# Altium project PCB_Project1.PrjPCB
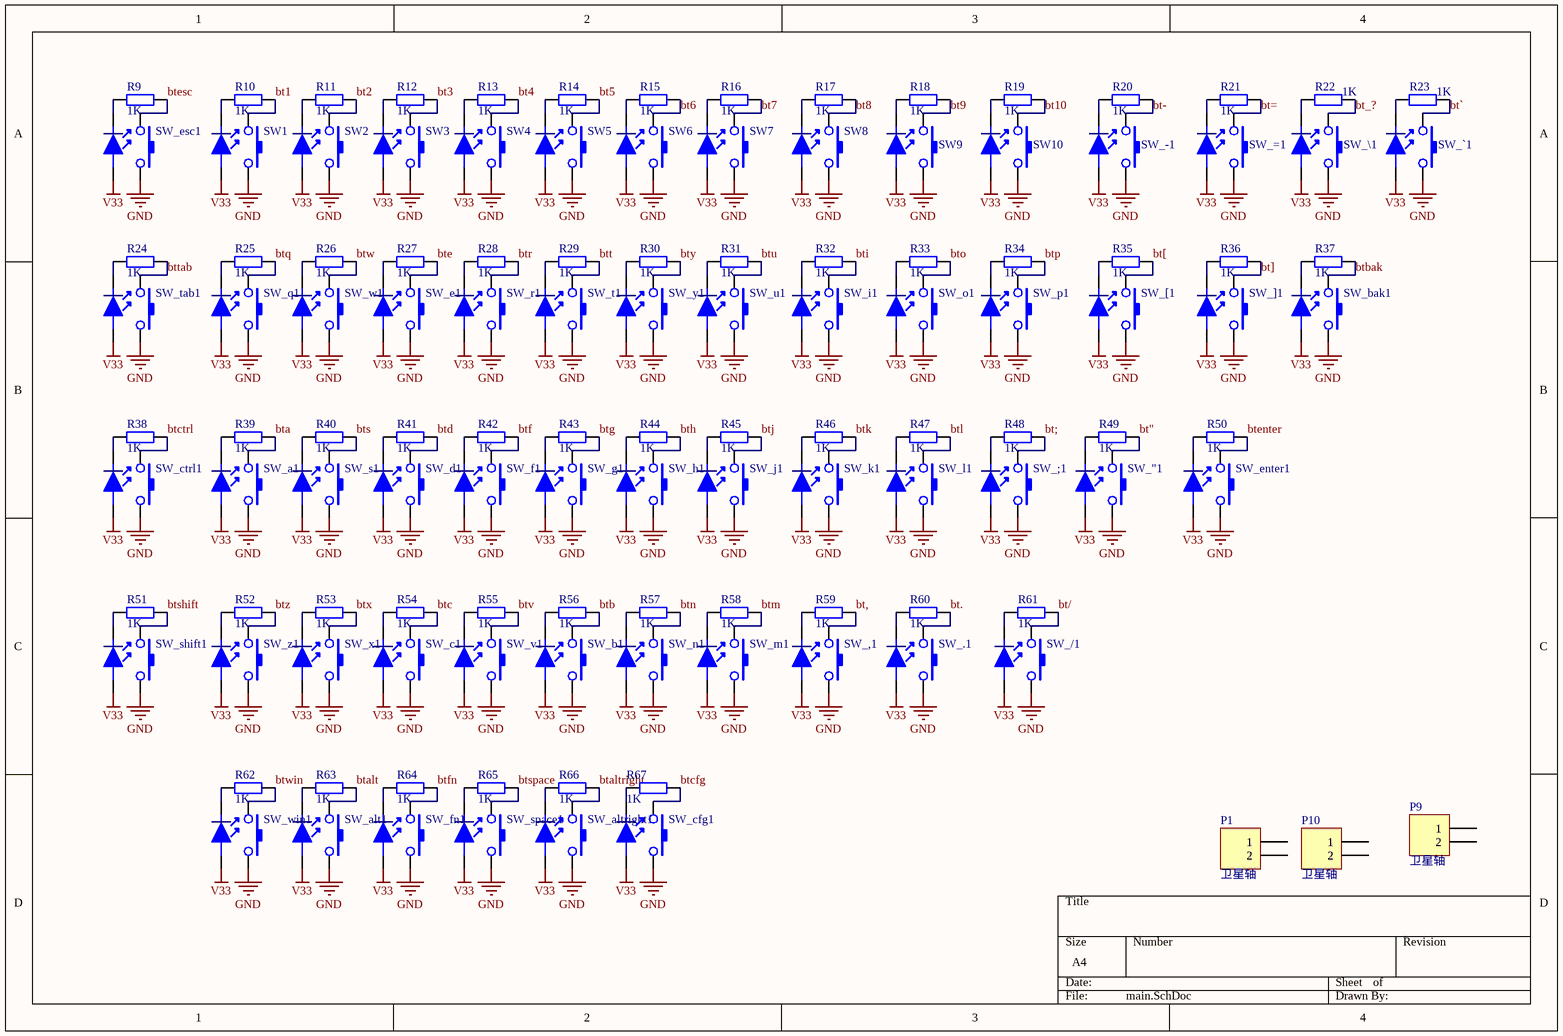
[diagram p0: main.SchDoc]
2 sheets, 150 parts. Net scope: global (net labels, ports and power ports of the same name join across sheets).
Board files: KBV1.2.PcbDoc, KBV1.3.PcbDoc
Sheets:
  main.SchDoc
  STM32F103VE.SchDoc

## Sheet main.SchDoc
size A4

### Parts
P1  卫星轴  [1x3]
P9  卫星轴  [1x2]
P10  卫星轴  [1x2]
R9  value 1K  [RES0805(2012M)]  (hidden comment: Res2)
R10  value 1K  [RES0805(2012M)]  (hidden comment: Res2)
R11  value 1K  [RES0805(2012M)]  (hidden comment: Res2)
R12  value 1K  [RES0805(2012M)]  (hidden comment: Res2)
R13  value 1K  [RES0805(2012M)]  (hidden comment: Res2)
R14  value 1K  [RES0805(2012M)]  (hidden comment: Res2)
R15  value 1K  [RES0805(2012M)]  (hidden comment: Res2)
R16  value 1K  [RES0805(2012M)]  (hidden comment: Res2)
R17  value 1K  [RES0805(2012M)]  (hidden comment: Res2)
R18  value 1K  [RES0805(2012M)]  (hidden comment: Res2)
R19  value 1K  [RES0805(2012M)]  (hidden comment: Res2)
R20  value 1K  [RES0805(2012M)]  (hidden comment: Res2)
R21  value 1K  [RES0805(2012M)]  (hidden comment: Res2)
R22  value 1K  [RES0805(2012M)]  (hidden comment: Res2)
R23  value 1K  [RES0805(2012M)]  (hidden comment: Res2)
R24  value 1K  [RES0805(2012M)]  (hidden comment: Res2)
R25  value 1K  [RES0805(2012M)]  (hidden comment: Res2)
R26  value 1K  [RES0805(2012M)]  (hidden comment: Res2)
R27  value 1K  [RES0805(2012M)]  (hidden comment: Res2)
R28  value 1K  [RES0805(2012M)]  (hidden comment: Res2)
R29  value 1K  [RES0805(2012M)]  (hidden comment: Res2)
R30  value 1K  [RES0805(2012M)]  (hidden comment: Res2)
R31  value 1K  [RES0805(2012M)]  (hidden comment: Res2)
R32  value 1K  [RES0805(2012M)]  (hidden comment: Res2)
R33  value 1K  [RES0805(2012M)]  (hidden comment: Res2)
R34  value 1K  [RES0805(2012M)]  (hidden comment: Res2)
R35  value 1K  [RES0805(2012M)]  (hidden comment: Res2)
R36  value 1K  [RES0805(2012M)]  (hidden comment: Res2)
R37  value 1K  [RES0805(2012M)]  (hidden comment: Res2)
R38  value 1K  [RES0805(2012M)]  (hidden comment: Res2)
R39  value 1K  [RES0805(2012M)]  (hidden comment: Res2)
R40  value 1K  [RES0805(2012M)]  (hidden comment: Res2)
R41  value 1K  [RES0805(2012M)]  (hidden comment: Res2)
R42  value 1K  [RES0805(2012M)]  (hidden comment: Res2)
R43  value 1K  [RES0805(2012M)]  (hidden comment: Res2)
R44  value 1K  [RES0805(2012M)]  (hidden comment: Res2)
R45  value 1K  [RES0805(2012M)]  (hidden comment: Res2)
R46  value 1K  [RES0805(2012M)]  (hidden comment: Res2)
R47  value 1K  [RES0805(2012M)]  (hidden comment: Res2)
R48  value 1K  [RES0805(2012M)]  (hidden comment: Res2)
R49  value 1K  [RES0805(2012M)]  (hidden comment: Res2)
R50  value 1K  [RES0805(2012M)]  (hidden comment: Res2)
R51  value 1K  [RES0805(2012M)]  (hidden comment: Res2)
R52  value 1K  [RES0805(2012M)]  (hidden comment: Res2)
R53  value 1K  [RES0805(2012M)]  (hidden comment: Res2)
R54  value 1K  [RES0805(2012M)]  (hidden comment: Res2)
R55  value 1K  [RES0805(2012M)]  (hidden comment: Res2)
R56  value 1K  [RES0805(2012M)]  (hidden comment: Res2)
R57  value 1K  [RES0805(2012M)]  (hidden comment: Res2)
R58  value 1K  [RES0805(2012M)]  (hidden comment: Res2)
R59  value 1K  [RES0805(2012M)]  (hidden comment: Res2)
R60  value 1K  [RES0805(2012M)]  (hidden comment: Res2)
R61  value 1K  [RES0805(2012M)]  (hidden comment: Res2)
R62  value 1K  [RES0805(2012M)]  (hidden comment: Res2)
R63  value 1K  [RES0805(2012M)]  (hidden comment: Res2)
R64  value 1K  [RES0805(2012M)]  (hidden comment: Res2)
R65  value 1K  [RES0805(2012M)]  (hidden comment: Res2)
R66  value 1K  [RES0805(2012M)]  (hidden comment: Res2)
R67  value 1K  [RES0805(2012M)]  (hidden comment: Res2)
SW1  (no value)  [MX_SW-5]
SW2  (no value)  [MX_SW-5]
SW3  (no value)  [MX_SW-5]
SW4  (no value)  [MX_SW-5]
SW5  (no value)  [MX_SW-5]
SW6  (no value)  [MX_SW-5]
SW7  (no value)  [MX_SW-5]
SW8  (no value)  [MX_SW-5]
SW9  (no value)  [MX_SW-5]
SW10  (no value)  [MX_SW-5]
SW_"1  (no value)  [MX_SW-5]
SW_,1  (no value)  [MX_SW-5]
SW_-1  (no value)  [MX_SW-5]
SW_.1  (no value)  [MX_SW-5]
SW_/1  (no value)  [MX_SW-5]
SW_;1  (no value)  [MX_SW-5]
SW_=1  (no value)  [MX_SW-5]
SW_[1  (no value)  [MX_SW-5]
SW_\1  (no value)  [MX_SW-5]
SW_]1  (no value)  [MX_SW-5]
SW_`1  (no value)  [MX_SW-5]
SW_a1  (no value)  [MX_SW-5]
SW_alt1  (no value)  [MX_SW-5]
SW_altright1  (no value)  [MX_SW-5]
SW_b1  (no value)  [MX_SW-5]
SW_bak1  (no value)  [MX_SW-5]
SW_c1  (no value)  [MX_SW-5]
SW_cfg1  (no value)  [MX_SW-5]
SW_ctrl1  (no value)  [MX_SW-5]
SW_d1  (no value)  [MX_SW-5]
SW_e1  (no value)  [MX_SW-5]
SW_enter1  (no value)  [MX_SW-5]
SW_esc1  (no value)  [MX_SW-5]
SW_f1  (no value)  [MX_SW-5]
SW_fn1  (no value)  [MX_SW-5]
SW_g1  (no value)  [MX_SW-5]
SW_h1  (no value)  [MX_SW-5]
SW_i1  (no value)  [MX_SW-5]
SW_j1  (no value)  [MX_SW-5]
SW_k1  (no value)  [MX_SW-5]
SW_l1  (no value)  [MX_SW-5]
SW_m1  (no value)  [MX_SW-5]
SW_n1  (no value)  [MX_SW-5]
SW_o1  (no value)  [MX_SW-5]
SW_p1  (no value)  [MX_SW-5]
SW_q1  (no value)  [MX_SW-5]
SW_r1  (no value)  [MX_SW-5]
SW_s1  (no value)  [MX_SW-5]
SW_shift1  (no value)  [MX_SW-5]
SW_space1  (no value)  [MX_SW-5]
SW_t1  (no value)  [MX_SW-5]
SW_tab1  (no value)  [MX_SW-5]
SW_u1  (no value)  [MX_SW-5]
SW_v1  (no value)  [MX_SW-5]
SW_w1  (no value)  [MX_SW-5]
SW_win1  (no value)  [MX_SW-5]
SW_x1  (no value)  [MX_SW-5]
SW_y1  (no value)  [MX_SW-5]
SW_z1  (no value)  [MX_SW-5]

### Nets
GND: SW1.1 SW2.1 SW3.1 SW4.1 SW5.1 SW6.1 SW7.1 SW8.1 SW9.1 SW10.1 SW_"1.1 SW_,1.1 SW_-1.1 SW_.1.1 SW_/1.1 SW_;1.1 SW_=1.1 SW_[1.1 SW_\1.1 SW_]1.1 SW_`1.1 SW_a1.1 SW_alt1.1 SW_altright1.1 SW_b1.1 SW_bak1.1 SW_c1.1 SW_cfg1.1 SW_ctrl1.1 SW_d1.1 SW_e1.1 SW_enter1.1 SW_esc1.1 SW_f1.1 SW_fn1.1 SW_g1.1 SW_h1.1 SW_i1.1 SW_j1.1 SW_k1.1 SW_l1.1 SW_m1.1 SW_n1.1 SW_o1.1 SW_p1.1 SW_q1.1 SW_r1.1 SW_s1.1 SW_shift1.1 SW_space1.1 SW_t1.1 SW_tab1.1 SW_u1.1 SW_v1.1 SW_w1.1 SW_win1.1 SW_x1.1 SW_y1.1 SW_z1.1
V33: SW1.3 SW2.3 SW3.3 SW4.3 SW5.3 SW6.3 SW7.3 SW8.3 SW9.3 SW10.3 SW_"1.3 SW_,1.3 SW_-1.3 SW_.1.3 SW_/1.3 SW_;1.3 SW_=1.3 SW_[1.3 SW_\1.3 SW_]1.3 SW_`1.3 SW_a1.3 SW_alt1.3 SW_altright1.3 SW_b1.3 SW_bak1.3 SW_c1.3 SW_cfg1.3 SW_ctrl1.3 SW_d1.3 SW_e1.3 SW_enter1.3 SW_esc1.3 SW_f1.3 SW_fn1.3 SW_g1.3 SW_h1.3 SW_i1.3 SW_j1.3 SW_k1.3 SW_l1.3 SW_m1.3 SW_n1.3 SW_o1.3 SW_p1.3 SW_q1.3 SW_r1.3 SW_s1.3 SW_shift1.3 SW_space1.3 SW_t1.3 SW_tab1.3 SW_u1.3 SW_v1.3 SW_w1.3 SW_win1.3 SW_x1.3 SW_y1.3 SW_z1.3
bt1: R10.2 SW1.2
bt2: R11.2 SW2.2
bt3: R12.2 SW3.2
bt4: R13.2 SW4.2
bt5: R14.2 SW5.2
bt6: R15.2 SW6.2
bt7: R16.2 SW7.2
bt8: R17.2 SW8.2
bt9: R18.2 SW9.2
bt10: R19.2 SW10.2
bt": R49.2 SW_"1.2
bt,: R59.2 SW_,1.2
bt-: R20.2 SW_-1.2
bt.: R60.2 SW_.1.2
bt/: R61.2 SW_/1.2
bt;: R48.2 SW_;1.2
bt=: R21.2 SW_=1.2
bt[: R35.2 SW_[1.2
bt]: R36.2 SW_]1.2
bt_?: R22.2 SW_\1.2
bt`: R23.1 SW_`1.2
bta: R39.2 SW_a1.2
btalt: R63.2 SW_alt1.2
btaltright: R66.2 SW_altright1.2
btb: R56.2 SW_b1.2
btbak: R37.2 SW_bak1.2
btc: R54.2 SW_c1.2
btcfg: R67.2 SW_cfg1.2
btctrl: R38.2 SW_ctrl1.2
btd: R41.2 SW_d1.2
bte: R27.2 SW_e1.2
btenter: R50.2 SW_enter1.2
btesc: R9.2 SW_esc1.2
btf: R42.2 SW_f1.2
btfn: R64.2 SW_fn1.2
btg: R43.2 SW_g1.2
bth: R44.2 SW_h1.2
bti: R32.2 SW_i1.2
btj: R45.2 SW_j1.2
btk: R46.2 SW_k1.2
btl: R47.2 SW_l1.2
btm: R58.2 SW_m1.2
btn: R57.2 SW_n1.2
bto: R33.2 SW_o1.2
btp: R34.2 SW_p1.2
btq: R25.2 SW_q1.2
btr: R28.2 SW_r1.2
bts: R40.2 SW_s1.2
btshift: R51.2 SW_shift1.2
btspace: R65.2 SW_space1.2
btt: R29.2 SW_t1.2
bttab: R24.2 SW_tab1.2
btu: R31.2 SW_u1.2
btv: R55.2 SW_v1.2
btw: R26.2 SW_w1.2
btwin: R62.2 SW_win1.2
btx: R53.2 SW_x1.2
bty: R30.2 SW_y1.2
btz: R52.2 SW_z1.2
NetR9_1: R9.1 SW_esc1.4
NetR10_1: R10.1 SW1.4
NetR11_1: R11.1 SW2.4
NetR12_1: R12.1 SW3.4
NetR13_1: R13.1 SW4.4
NetR14_1: R14.1 SW5.4
NetR15_1: R15.1 SW6.4
NetR16_1: R16.1 SW7.4
NetR17_1: R17.1 SW8.4
NetR18_1: R18.1 SW9.4
NetR19_1: R19.1 SW10.4
NetR20_1: R20.1 SW_-1.4
NetR21_1: R21.1 SW_=1.4
NetR22_1: R22.1 SW_\1.4
NetR23_2: R23.2 SW_`1.4
NetR24_1: R24.1 SW_tab1.4
NetR25_1: R25.1 SW_q1.4
NetR26_1: R26.1 SW_w1.4
NetR27_1: R27.1 SW_e1.4
NetR28_1: R28.1 SW_r1.4
NetR29_1: R29.1 SW_t1.4
NetR30_1: R30.1 SW_y1.4
NetR31_1: R31.1 SW_u1.4
NetR32_1: R32.1 SW_i1.4
NetR33_1: R33.1 SW_o1.4
NetR34_1: R34.1 SW_p1.4
NetR35_1: R35.1 SW_[1.4
NetR36_1: R36.1 SW_]1.4
NetR37_1: R37.1 SW_bak1.4
NetR38_1: R38.1 SW_ctrl1.4
NetR39_1: R39.1 SW_a1.4
NetR40_1: R40.1 SW_s1.4
NetR41_1: R41.1 SW_d1.4
NetR42_1: R42.1 SW_f1.4
NetR43_1: R43.1 SW_g1.4
NetR44_1: R44.1 SW_h1.4
NetR45_1: R45.1 SW_j1.4
NetR46_1: R46.1 SW_k1.4
NetR47_1: R47.1 SW_l1.4
NetR48_1: R48.1 SW_;1.4
NetR49_1: R49.1 SW_"1.4
NetR50_1: R50.1 SW_enter1.4
NetR51_1: R51.1 SW_shift1.4
NetR52_1: R52.1 SW_z1.4
NetR53_1: R53.1 SW_x1.4
NetR54_1: R54.1 SW_c1.4
NetR55_1: R55.1 SW_v1.4
NetR56_1: R56.1 SW_b1.4
NetR57_1: R57.1 SW_n1.4
NetR58_1: R58.1 SW_m1.4
NetR59_1: R59.1 SW_,1.4
NetR60_1: R60.1 SW_.1.4
NetR61_1: R61.1 SW_/1.4
NetR62_1: R62.1 SW_win1.4
NetR63_1: R63.1 SW_alt1.4
NetR64_1: R64.1 SW_fn1.4
NetR65_1: R65.1 SW_space1.4
NetR66_1: R66.1 SW_altright1.4
NetR67_1: R67.1 SW_cfg1.4

Not connected (* = marked no-connect by the designer): P1 1 2; P9 1 2; P10 1 2

### Library data of the parts
P1 P9 P10 = Header 2: Header, 2-Pin; LatestRevisionDate: 17-Jul-2002; LatestRevisionNote: Re-released for DXP Platform.; Publisher: Altium Limited
R9-R67 = Res2: Resistor; Published: 8-Jun-2000; LatestRevisionDate: 17-Jul-2002; LatestRevisionNote: Re-released for DXP Platform.; PackageReference: AXIAL-0.4; Publisher: Altium Limited; PackageDescription: Axial Device, Thru-Hole; 2 Leads; 0.4 in Pin Spacing
SW1-SW10 SW_"1 SW_,1 SW_-1 SW_.1 SW_/1 SW_;1 SW_=1 SW_[1 SW_\1 SW_]1 SW_`1 SW_a1 SW_alt1 SW_altright1 SW_b1 SW_bak1 SW_c1 SW_cfg1 SW_ctrl1 SW_d1 SW_e1 SW_enter1 SW_esc1 SW_f1 SW_fn1 SW_g1 SW_h1 SW_i1 SW_j1 SW_k1 SW_l1 SW_m1 SW_n1 SW_o1 SW_p1 SW_q1 SW_r1 SW_s1 SW_shift1 SW_space1 SW_t1 SW_tab1 SW_u1 SW_v1 SW_w1 SW_win1 SW_x1 SW_y1 SW_z1 = MX_SW-5: with Fixation pins  1-Pole w/LED

## Sheet STM32F103VE.SchDoc
size A4
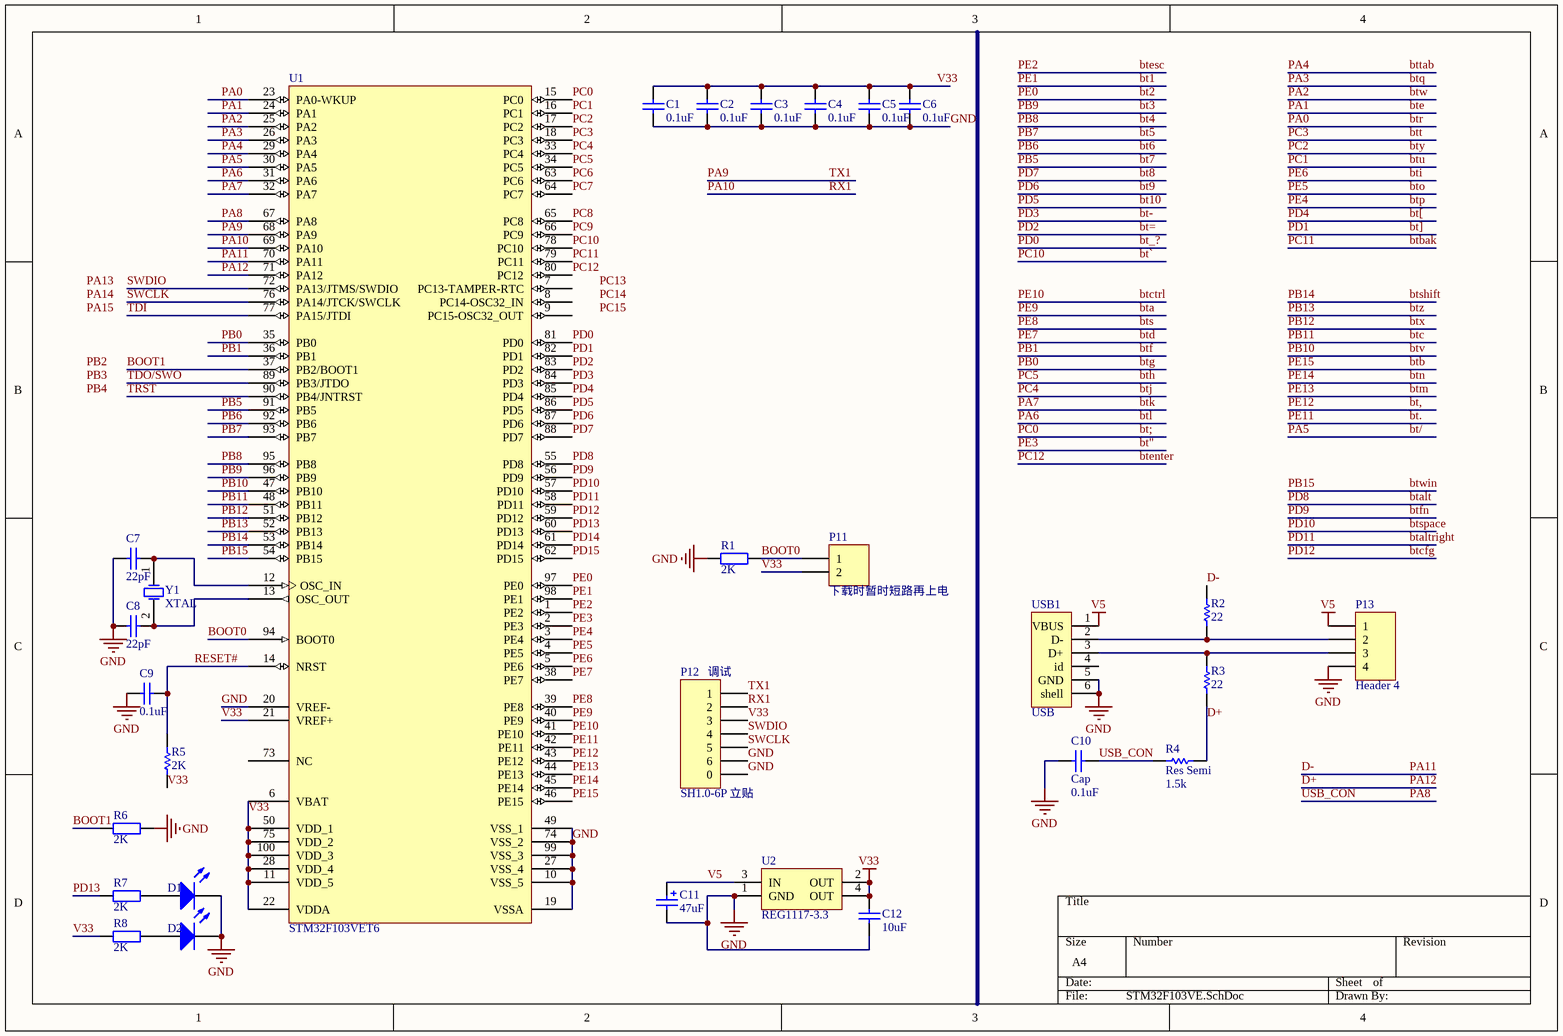
[diagram p1: STM32F103VE.SchDoc]

### Parts
C1  value 0.1uF  [CAP0805(2512)]  (hidden comment: Cap)
C2  value 0.1uF  [CAP0805(2512)]  (hidden comment: Cap)
C3  value 0.1uF  [CAP0805(2512)]  (hidden comment: Cap)
C4  value 0.1uF  [CAP0805(2512)]  (hidden comment: Cap)
C5  value 0.1uF  [CAP0805(2512)]  (hidden comment: Cap)
C6  value 0.1uF  [CAP0805(2512)]  (hidden comment: Cap)
C7  value 22pF  [CAP0805(2512)]  (hidden comment: Cap)
C8  value 22pF  [CAP0805(2512)]  (hidden comment: Cap)
C9  value 0.1uF  [CAP0805(2512)]  (hidden comment: Cap)
C10  Cap  value 0.1uF  [CAP0805(2512)]
C11  value 47uF  [CAP0805(2512)]  (hidden comment: Cap Pol2)
C12  value 10uF  [CAP0805(2512)]  (hidden comment: Cap)
D1  LED0  [DIODE_100mil]  (value not drawn)
D2  LED0  [DIODE_100mil]  (value not drawn)
P11  下载时暂时短路再上电  [HDR1X2]
P12  SH1.0-6P 立贴  [SH1.0-6P立]
P13  Header 4  [HDR1X4]
R1  value 2K  [RES0805(2012M)]  (hidden comment: Res2)
R2  value 22  [RES0805(2012M)]  (hidden comment: Res Semi)
R3  value 22  [RES0805(2012M)]  (hidden comment: Res Semi)
R4  Res Semi  value 1.5k  [RES0805(2012M)]
R5  value 2K  [RES0805(2012M)]  (hidden comment: Res Semi)
R6  value 2K  [RES0805(2012M)]  (hidden comment: Res2)
R7  value 2K  [RES0805(2012M)]  (hidden comment: Res2)
R8  value 2K  [RES0805(2012M)]  (hidden comment: Res2)
U1  STM32F103VET6  [LQFP-100]
U2  REG1117-3.3  [ZZ311]
USB1  USB  [MICRO-USB]
Y1  XTAL  [XTAL_0.4]

### Nets
GND: C1.1 C2.1 C3.1 C4.1 C5.1 C6.1 C7.1 C8.1 C9.2 C10.2 C11.2 C12.1 D1.2(K) D2.2(K) P12.0 P12.6 P13.4 R1.2 R6.1 U1.10(VSS_5) U1.19(VSSA) U1.20(VREF-) U1.27(VSS_4) U1.49(VSS_1) U1.74(VSS_2) U1.99(VSS_3) U2.1(GND) USB1.5(GND) USB1.6(shell)
V5: C11.1 P13.1 U2.3(IN) USB1.1(VBUS)
V33: C1.2 C2.2 C3.2 C4.2 C5.2 C6.2 C12.2 P11.2 P12.3 R5.1 R8.1 U1.6(VBAT) U1.11(VDD_5) U1.21(VREF+) U1.22(VDDA) U1.28(VDD_4) U1.50(VDD_1) U1.75(VDD_2) U1.100(VDD_3) U2.2(OUT) U2.4(OUT)
BOOT0: P11.1 R1.1 U1.94(BOOT0)
BOOT1: R6.2 U1.37(PB2/BOOT1)
bt1: U1.98(PE1)  [also labelled PE1]
bt2: U1.97(PE0)  [also labelled PE0]
bt3: U1.96(PB9)  [also labelled PB9]
bt4: U1.95(PB8)  [also labelled PB8]
bt5: U1.93(PB7)  [also labelled PB7]
bt6: U1.92(PB6)  [also labelled PB6]
bt7: U1.91(PB5)  [also labelled PB5]
bt8: U1.88(PD7)  [also labelled PD7]
bt9: U1.87(PD6)  [also labelled PD6]
bt10: U1.86(PD5)  [also labelled PD5]
bt": U1.2(PE3)  [also labelled PE3]
bt,: U1.43(PE12)  [also labelled PE12]
bt-: U1.84(PD3)  [also labelled PD3]
bt.: U1.42(PE11)  [also labelled PE11]
bt/: U1.30(PA5)  [also labelled PA5]
bt;: U1.15(PC0)  [also labelled PC0]
bt=: U1.83(PD2)  [also labelled PD2]
bt[: U1.85(PD4)  [also labelled PD4]
bt]: U1.82(PD1)  [also labelled PD1]
bt_?: U1.81(PD0)  [also labelled PD0]
bt`: U1.78(PC10)  [also labelled PC10]
bta: U1.40(PE9)  [also labelled PE9]
btalt: U1.55(PD8)  [also labelled PD8]
btaltright: U1.58(PD11)  [also labelled PD11]
btb: U1.46(PE15)  [also labelled PE15]
btbak: U1.79(PC11)  [also labelled PC11]
btc: U1.48(PB11)  [also labelled PB11]
btcfg: U1.59(PD12)  [also labelled PD12]
btctrl: U1.41(PE10)  [also labelled PE10]
btd: U1.38(PE7)  [also labelled PE7]
bte: U1.24(PA1)  [also labelled PA1]
btenter: U1.80(PC12)  [also labelled PC12]
btesc: U1.1(PE2)  [also labelled PE2]
btf: U1.36(PB1)  [also labelled PB1]
btfn: U1.56(PD9)  [also labelled PD9]
btg: U1.35(PB0)  [also labelled PB0]
bth: U1.34(PC5)  [also labelled PC5]
bti: U1.5(PE6)  [also labelled PE6]
btj: U1.33(PC4)  [also labelled PC4]
btk: U1.32(PA7)  [also labelled PA7]
btl: U1.31(PA6)  [also labelled PA6]
btm: U1.44(PE13)  [also labelled PE13]
btn: U1.45(PE14)  [also labelled PE14]
bto: U1.4(PE5)  [also labelled PE5]
btp: U1.3(PE4)  [also labelled PE4]
btq: U1.26(PA3)  [also labelled PA3]
btr: U1.23(PA0-WKUP)  [also labelled PA0]
bts: U1.39(PE8)  [also labelled PE8]
btshift: U1.53(PB14)  [also labelled PB14]
btspace: U1.57(PD10)  [also labelled PD10]
btt: U1.18(PC3)  [also labelled PC3]
bttab: U1.29(PA4)  [also labelled PA4]
btu: U1.16(PC1)  [also labelled PC1]
btv: U1.47(PB10)  [also labelled PB10]
btw: U1.25(PA2)  [also labelled PA2]
btwin: U1.54(PB15)  [also labelled PB15]
btx: U1.51(PB12)  [also labelled PB12]
bty: U1.17(PC2)  [also labelled PC2]
btz: U1.52(PB13)  [also labelled PB13]
D+: R3.2 R4.2 U1.71(PA12)  [also labelled PA12]
D-: R2.2 U1.70(PA11)  [also labelled PA11]
PA8: C10.1 R4.1 U1.67(PA8)  [also labelled USB_CON]
PA9: P12.1 U1.68(PA9)  [also labelled TX1]
PA10: P12.2 U1.69(PA10)  [also labelled RX1]
PC6: U1.63(PC6)
PC7: U1.64(PC7)
PC8: U1.65(PC8)
PC9: U1.66(PC9)
PD13: R7.1 U1.60(PD13)
PD14: U1.61(PD14)
PD15: U1.62(PD15)
RESET#: C9.1 R5.2 U1.14(NRST)
SWCLK: P12.5 U1.76(PA14/JTCK/SWCLK)
SWDIO: P12.4 U1.72(PA13/JTMS/SWDIO)
TDI: U1.77(PA15/JTDI)
TDO/SWO: U1.89(PB3/JTDO)
TRST: U1.90(PB4/JNTRST)
NetC7_2: C7.2 U1.12(OSC_IN) Y1.1(OSC1)
NetC8_2: C8.2 U1.13(OSC_OUT) Y1.2(OSC2)
NetD1_1: D1.1(A) R7.2
NetD2_1: D2.1(A) R8.2
NetP13_2: P13.2 R2.1 USB1.2(D-)
NetP13_3: P13.3 R3.1 USB1.3(D+)

Not connected (* = marked no-connect by the designer): U1 7(PC13-TAMPER-RTC) 8(PC14-OSC32_IN) 9(PC15-OSC32_OUT) 73(NC); USB1 4(id)

### Notes on the sheet
- (near P12) 调试
- Labels drawn without touching a wire or pin: PA13, PA14, PA15, PB2, PB3, PB4, PC13, PC14, PC15

### Library data of the parts
C1-C10 C12 = Cap: Capacitor; Published: 8-Jun-2000; LatestRevisionDate: 17-Jul-2002; LatestRevisionNote: Re-released for DXP Platform.; PackageReference: RAD-0.3; Publisher: Altium Limited
C11 = Cap Pol2: Polarized Capacitor (Axial); Published: 8-Jun-2000; LatestRevisionDate: 17-Jul-2002; LatestRevisionNote: Re-released for DXP Platform.; PackageReference: POLAR0.8; Publisher: Altium Limited; PackageDescription: Polarized Capacitor; 2 Leads
D1 D2 = LED0: Typical INFRARED GaAs LED; Published: 8-Jun-2000; LatestRevisionDate: 08-Jul-2005; LatestRevisionNote: Mech Layer 1 removed.; PackageReference: LED-0; Publisher: Altium Limited
P11 = Header 2: Header, 2-Pin; LatestRevisionDate: 17-Jul-2002; LatestRevisionNote: Re-released for DXP Platform.; Publisher: Altium Limited
P12 = Header 7: Header, 7-Pin; LatestRevisionDate: 17-Jul-2002; LatestRevisionNote: Re-released for DXP Platform.; Publisher: Altium Limited
P13 = Header 4: Header, 4-Pin; LatestRevisionDate: 17-Jul-2002; LatestRevisionNote: Re-released for DXP Platform.; Publisher: Altium Limited
R1 R6-R8 = Res2: Resistor; Published: 8-Jun-2000; LatestRevisionDate: 17-Jul-2002; LatestRevisionNote: Re-released for DXP Platform.; PackageReference: AXIAL-0.4; Publisher: Altium Limited
R2-R5 = Res Semi: Semiconductor Resistor; Published: 8-Jun-2000; LatestRevisionDate: 17-Jul-2002; LatestRevisionNote: Re-released for DXP Platform.; Publisher: Altium Limited
  R2-R4: PackageReference: RES0805(2012M)
  R5: PackageReference: AXIAL-0.5
U1 = STM32F103VBT6: STM32 ARM-based 32-bit MCU with 64 Kbytes Flash, 100-pin LQFP, Industrial Temperature; Published: 30-May-2008; DatasheetVersion: rev6, Mar-2008; PackageVersion: Mar-2008; PackageReference: LQFP100; Publisher: Altium Limited; PackageDescription: 100-Pin Low-Profile Quad Flat Pack, 14 x 14 mm Body, 0.5 mm Pitch (LQFP100); ComponentLink1Description: Manufacturer Link; ComponentLink1URL: www.st.com/stm32; ComponentLink2Description: Datasheet; ComponentLink2URL: http://www.st.com/stonline/products/literature/ds/13587.pdf
U2 = REG1117-3.3: 800mA and 1A Low Dropout Positive Regulator 2.85V, 3.3V, 5V, and Adjustable; Published: 8-Jun-2000; LatestRevisionDate: 17-Jul-2002; LatestRevisionNote: Re-released for DXP Platform.; DatasheetVersion: Sep-1997; PackageVersion: revC; PackageReference: ZZ311; Publisher: Altium Limited; PackageDescription: SOT-223/SC-73; 4 Leads; Body 6.7 x 7.3 mm, inc. leads (LxW max); ComponentLink1Description: Manufacturer Link; ComponentLink1URL: http://www.ti.com/; ComponentLink2Description: Datasheet; ComponentLink2URL: http://www-s.ti.com/sc/ds/REG1117.pdf
Y1 = XTAL: Crystal Oscillator; Published: 8-Jun-2000; LatestRevisionDate: 17-Jul-2002; LatestRevisionNote: Re-released for DXP Platform.; PackageReference: R38; Publisher: Altium Limited

## Nets that join several sheets
GND: main (59 pins), STM32F103VE (29 pins)
V33: main (59 pins), STM32F103VE (21 pins)
bt1: main (R10.2 SW1.2), STM32F103VE (U1.98)
bt2: main (R11.2 SW2.2), STM32F103VE (U1.97)
bt3: main (R12.2 SW3.2), STM32F103VE (U1.96)
bt4: main (R13.2 SW4.2), STM32F103VE (U1.95)
bt5: main (R14.2 SW5.2), STM32F103VE (U1.93)
bt6: main (R15.2 SW6.2), STM32F103VE (U1.92)
bt7: main (R16.2 SW7.2), STM32F103VE (U1.91)
bt8: main (R17.2 SW8.2), STM32F103VE (U1.88)
bt9: main (R18.2 SW9.2), STM32F103VE (U1.87)
bt10: main (R19.2 SW10.2), STM32F103VE (U1.86)
bt": main (R49.2 SW_"1.2), STM32F103VE (U1.2)
bt,: main (R59.2 SW_,1.2), STM32F103VE (U1.43)
bt-: main (R20.2 SW_-1.2), STM32F103VE (U1.84)
bt.: main (R60.2 SW_.1.2), STM32F103VE (U1.42)
bt/: main (R61.2 SW_/1.2), STM32F103VE (U1.30)
bt;: main (R48.2 SW_;1.2), STM32F103VE (U1.15)
bt=: main (R21.2 SW_=1.2), STM32F103VE (U1.83)
bt[: main (R35.2 SW_[1.2), STM32F103VE (U1.85)
bt]: main (R36.2 SW_]1.2), STM32F103VE (U1.82)
bt_?: main (R22.2 SW_\1.2), STM32F103VE (U1.81)
bt`: main (R23.1 SW_`1.2), STM32F103VE (U1.78)
bta: main (R39.2 SW_a1.2), STM32F103VE (U1.40)
btalt: main (R63.2 SW_alt1.2), STM32F103VE (U1.55)
btaltright: main (R66.2 SW_altright1.2), STM32F103VE (U1.58)
btb: main (R56.2 SW_b1.2), STM32F103VE (U1.46)
btbak: main (R37.2 SW_bak1.2), STM32F103VE (U1.79)
btc: main (R54.2 SW_c1.2), STM32F103VE (U1.48)
btcfg: main (R67.2 SW_cfg1.2), STM32F103VE (U1.59)
btctrl: main (R38.2 SW_ctrl1.2), STM32F103VE (U1.41)
btd: main (R41.2 SW_d1.2), STM32F103VE (U1.38)
bte: main (R27.2 SW_e1.2), STM32F103VE (U1.24)
btenter: main (R50.2 SW_enter1.2), STM32F103VE (U1.80)
btesc: main (R9.2 SW_esc1.2), STM32F103VE (U1.1)
btf: main (R42.2 SW_f1.2), STM32F103VE (U1.36)
btfn: main (R64.2 SW_fn1.2), STM32F103VE (U1.56)
btg: main (R43.2 SW_g1.2), STM32F103VE (U1.35)
bth: main (R44.2 SW_h1.2), STM32F103VE (U1.34)
bti: main (R32.2 SW_i1.2), STM32F103VE (U1.5)
btj: main (R45.2 SW_j1.2), STM32F103VE (U1.33)
btk: main (R46.2 SW_k1.2), STM32F103VE (U1.32)
btl: main (R47.2 SW_l1.2), STM32F103VE (U1.31)
btm: main (R58.2 SW_m1.2), STM32F103VE (U1.44)
btn: main (R57.2 SW_n1.2), STM32F103VE (U1.45)
bto: main (R33.2 SW_o1.2), STM32F103VE (U1.4)
btp: main (R34.2 SW_p1.2), STM32F103VE (U1.3)
btq: main (R25.2 SW_q1.2), STM32F103VE (U1.26)
btr: main (R28.2 SW_r1.2), STM32F103VE (U1.23)
bts: main (R40.2 SW_s1.2), STM32F103VE (U1.39)
btshift: main (R51.2 SW_shift1.2), STM32F103VE (U1.53)
btspace: main (R65.2 SW_space1.2), STM32F103VE (U1.57)
btt: main (R29.2 SW_t1.2), STM32F103VE (U1.18)
bttab: main (R24.2 SW_tab1.2), STM32F103VE (U1.29)
btu: main (R31.2 SW_u1.2), STM32F103VE (U1.16)
btv: main (R55.2 SW_v1.2), STM32F103VE (U1.47)
btw: main (R26.2 SW_w1.2), STM32F103VE (U1.25)
btwin: main (R62.2 SW_win1.2), STM32F103VE (U1.54)
btx: main (R53.2 SW_x1.2), STM32F103VE (U1.51)
bty: main (R30.2 SW_y1.2), STM32F103VE (U1.17)
btz: main (R52.2 SW_z1.2), STM32F103VE (U1.52)